# EAGLE design sim900 (EAGLE 6.4)
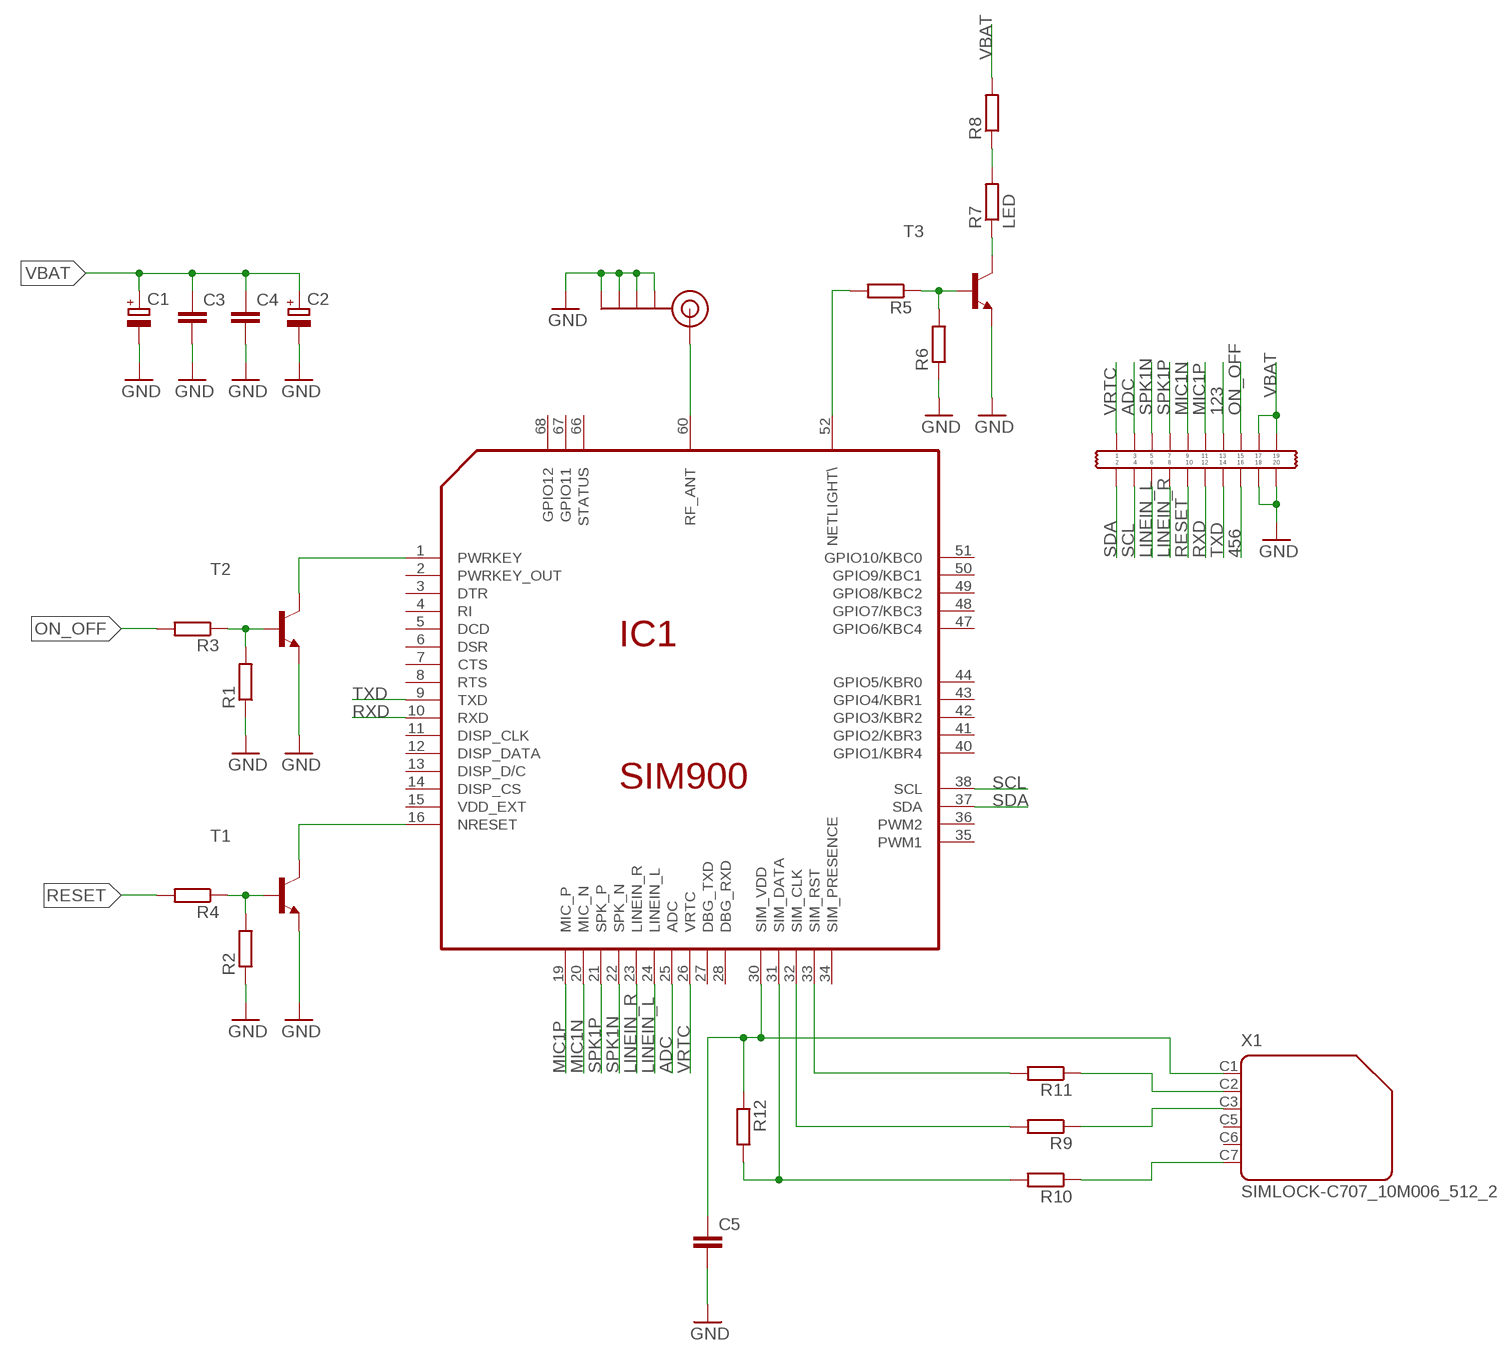
[diagram p0: schematic, sheet 1]

## Parts
C1  CPOL-EUSMCD  [SMC_D]
C2  CPOL-EUSMCD  [SMC_D]
C3  C-EUC0805K  [C0805K]
C4  C-EUC0805K  [C0805K]
C5  C-EUC1206K  [C1206K]
IC1  SIM900  [SIM900]
J$1  SMA_EDGE  [SMA-EDGE]
R1  R-EU_R0805  [R0805]
R2  R-EU_R0805  [R0805]
R3  R-EU_R0805  [R0805]
R4  R-EU_R0805  [R0805]
R5  R-EU_R0805  [R0805]
R6  R-EU_R0805  [R0805]
R7  LED  R-EU_R0805  [R0805]
R8  R-EU_R0805  [R0805]
R9  R-EU_R0805  [R0805]
R10  R-EU_R0805  [R0805]
R11  R-EU_R0805  [R0805]
R12  R-EU_R0805  [R0805]
T1  -NPN-SOT23-EBC  [SOT23-EBC]
T2  -NPN-SOT23-EBC  [SOT23-EBC]
T3  -NPN-SOT23-EBC  [SOT23-EBC]
U$1  2X10  [2X10]
X1  SIMLOCK-C707_10M006_512_2  [C707_10M006_512_2]

## Nets
123: U$1.T13(C13)
456: U$1.B16(C16)
ADC: IC1.25(ADC) U$1.T3(C3)
GND: C1.- C2.- C3.2 C4.2 C5.2 J$1.GND@0(GND) J$1.GND@1(GND) J$1.GND@2(GND) J$1.GND@3(GND) R1.1 R2.1 R6.1 T1.E T2.E T3.E U$1.B18(C18) U$1.B20(C20)
LINEIN_L: IC1.24(LINEIN_L) U$1.B6(C6)
LINEIN_R: IC1.23(LINEIN_R) U$1.B8(C8)
MIC1N: IC1.20(MIC_N) U$1.T9(C9)
MIC1P: IC1.19(MIC_P) U$1.T11(C11)
N$1: IC1.60(RF_ANT) J$1.SIG(SIGNAL)
N$2: IC1.1(PWRKEY) T2.C
N$3: IC1.16(NRESET) T1.C
N$4: R2.2 R4.1 T1.B
N$5: R1.2 R3.1 T2.B
N$6: C5.1 IC1.30(SIM_VDD) R12.1 X1.C1
N$7: R7.2 R8.1
N$8: R5.1 R6.2 T3.B
N$9: IC1.52(NETLIGHT\) R5.2
N$10: R7.1 T3.C
N$11: R11.1 X1.C2
N$12: IC1.33(SIM_RST) R11.2
N$13: R9.1 X1.C3
N$14: R10.1 X1.C7
N$15: IC1.32(SIM_CLK) R9.2
N$16: IC1.31(SIM_DATA) R10.2 R12.2
ON_OFF: R3.2 U$1.T15(C15)
RESET: R4.2 U$1.B10(C10)
RXD: IC1.10(RXD) U$1.B12(C12)
SCL: IC1.38(SCL) U$1.B4(C4)
SDA: IC1.37(SDA) U$1.B2(C2)
SPK1N: IC1.22(SPK_N) U$1.T5(C5)
SPK1P: IC1.21(SPK_P) U$1.T7(C7)
TXD: IC1.9(TXD) U$1.B14(C14)
VBAT: C1.+ C2.+ C3.1 C4.1 R8.2 U$1.T17(C17) U$1.T19(C19)
VRTC: IC1.26(VRTC) U$1.T1(C1)
Unconnected: IC1.2(PWRKEY_OUT) IC1.3(DTR) IC1.4(RI) IC1.5(DCD) IC1.6(DSR) IC1.7(CTS) IC1.8(RTS) IC1.11(DISP_CLK) IC1.12(DISP_DATA) IC1.13(DISP_D/C) IC1.14(DISP_CS) IC1.15(VDD_EXT) IC1.27(DBG_TXD) IC1.28(DBG_RXD) IC1.34(SIM_PRESENCE) IC1.35(PWM1) IC1.36(PWM2) IC1.40(GPIO1/KBR4) IC1.41(GPIO2/KBR3) IC1.42(GPIO3/KBR2) IC1.43(GPIO4/KBR1) IC1.44(GPIO5/KBR0) IC1.47(GPIO6/KBC4) IC1.48(GPIO7/KBC3) IC1.49(GPIO8/KBC2) IC1.50(GPIO9/KBC1) IC1.51(GPIO10/KBC0) IC1.66(STATUS) IC1.67(GPIO11) IC1.68(GPIO12) X1.C5 X1.C6

## Power pins joined to a net without a drawn wire
GND: IC1.17(GND) IC1.18(GND) IC1.29(GND) IC1.39(GND) IC1.45(GND) IC1.46(GND) IC1.53(GND) IC1.54(GND) IC1.58(GND) IC1.59(GND) IC1.61(GND) IC1.62(GND) IC1.63(GND) IC1.64(GND) IC1.65(GND)
VBAT: IC1.55(VBAT) IC1.56(VBAT) IC1.57(VBAT)

## Library data of the parts
C1 C2 = rcl:CPOL-EU: POLARIZED CAPACITOR, European symbol
C3-C5 = rcl:C-EU: CAPACITOR, European symbol
IC1 = sim900:SIM900
J$1 = SparkFun-Connectors:SMA_EDGE: SMA Antenna Connector End launch SMA connector. The paste layer has been removed so that the connector can be hand soldered onto the board after reflow.
R1-R12 = rcl:R-EU_: RESISTOR, European symbol
T1-T3 = transistor:*-NPN-: NPN Transistror BF959 corrected 2008.03.06
U$1 = pinhead_edge:2X10
X1 = con-amphenol:SIMLOCK-C707_10M006_512_2: C707A SIMLOCK® 2.5 mm with wide solder tails Source: Data sheet <http://www.amphenol.info/downloads/C707_10M006_512_2.pdf>; OC_FARNELL: unknown; OC_NEWARK: unknown

## Board
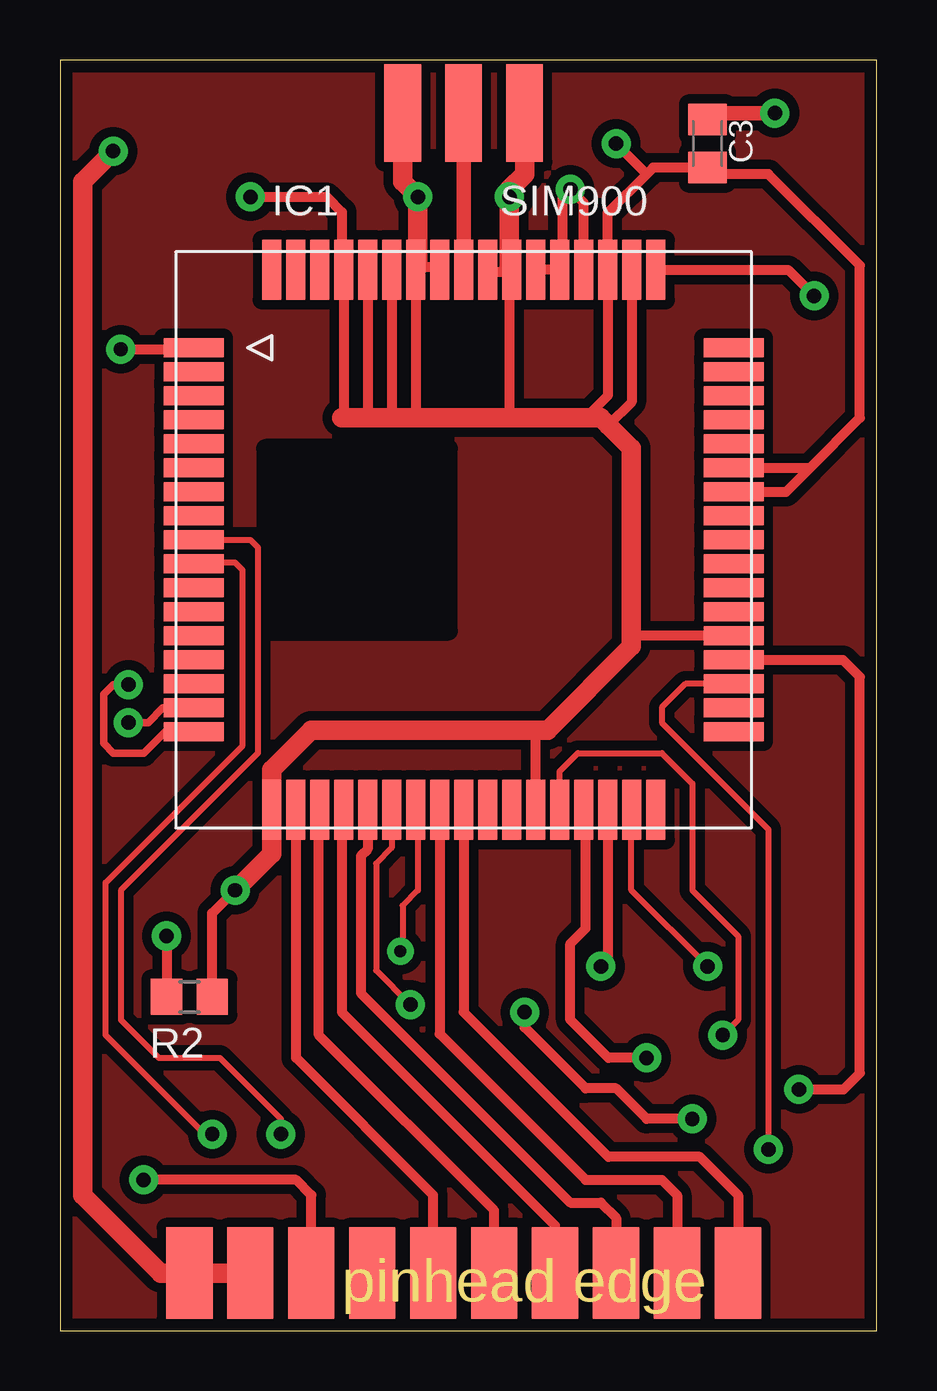
[diagram p1: board, top side]
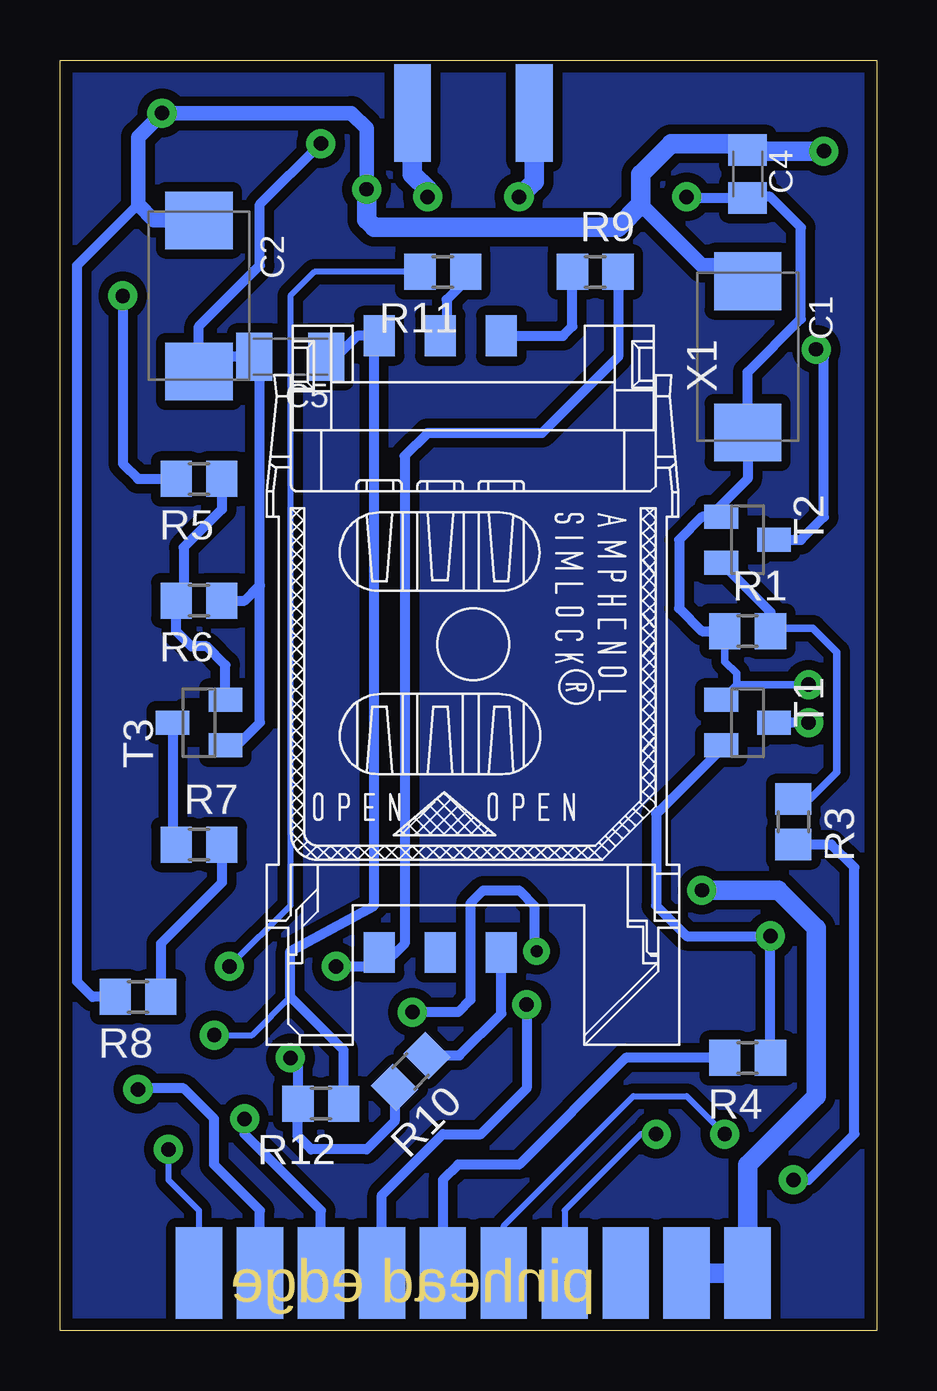
[diagram p2: board, bottom side, seen from below]

Size 34.04 x 52.95 mm. Coordinates in mm from the lower left corner, seen from the top.
Outline: 0,0 34.04,0 34.04,52.95 0,52.95 0,0
Copper layers (1*16): Top 0.035mm / dielectric 1.5mm / Bottom 0.035mm
Design rules "default": minimum track width 12mil, minimum drill 32mil, track to track 12mil, track to pad 12mil, pad to pad 12mil, via to via 12mil, smd to smd 8mil, copper to edge 20mil, drill to drill 20mil, minimum pad ring 25mil, minimum via ring 12mil, stop-mask expansion 4mil, vias tented up to drill 0mil, thermal gap 10mil
tRestrict: area 8.6,29.2 to 16.2,36.8; area 14.3,39 to 18.1,42.8; area 14.9,45.7 to 18.7,48.8
bRestrict: area 4.8,32.3 to 6.7,33.6; area 4.8,24.7 to 6,26.6; area 27.6,24.7 to 28.9,26

### Footprints (pad centres in the part's own frame; a part is rotated, then mirrored left to right if it is on the bottom)
SMC_D = smd 2.4 x 2.8: + -3.15,0; - 3.15,0
C0805K = smd 1.3 x 1.6: 1 -1,0; 2 1,0
C1206K = smd 1.5 x 2: 1 -1.5,0; 2 1.5,0
SIM900 = smd 2.5 x 0.8: 1 -11.25,8; 2 -11.25,7; 3 -11.25,6; 4 -11.25,5; 5 -11.25,4; 6 -11.25,3; 7 -11.25,2; 8 -11.25,1; 9 -11.25,0; 10 -11.25,-1; 11 -11.25,-2; 12 -11.25,-3; 13 -11.25,-4; 14 -11.25,-5; 15 -11.25,-6; 16 -11.25,-7; 17 -11.25,-8; 35 11.25,-8; 36 11.25,-7; 37 11.25,-6; 38 11.25,-5; 39 11.25,-4; 40 11.25,-3; 41 11.25,-2; 42 11.25,-1; 43 11.25,0; 44 11.25,1; 45 11.25,2; 46 11.25,3; 47 11.25,4; 48 11.25,5; 49 11.25,6; 50 11.25,7; 51 11.25,8 | smd 0.8 x 2.5: 18 -8,-11.25; 19 -7,-11.25; 20 -6,-11.25; 21 -5,-11.25; 22 -4,-11.25; 23 -3,-11.25; 24 -2,-11.25; 25 -1,-11.25; 26 0,-11.25; 27 1,-11.25; 28 2,-11.25; 29 3,-11.25; 30 4,-11.25; 31 5,-11.25; 32 6,-11.25; 33 7,-11.25; 34 8,-11.25; 52 8,11.25; 53 7,11.25; 54 6,11.25; 55 5,11.25; 56 4,11.25; 57 3,11.25; 58 2,11.25; 59 1,11.25; 60 0,11.25; 61 -1,11.25; 62 -2,11.25; 63 -3,11.25; 64 -4,11.25; 65 -5,11.25; 66 -6,11.25; 67 -7,11.25; 68 -8,11.25
SMA-EDGE = smd 1.524 x 4.064: GND@0 0,0; GND@1 5.08,0; SIG 2.54,0 | smd 1.524 x 4.064 bottom: GND@2 0,0; GND@3 5.08,0
R0805 = smd 1.3 x 1.5: 1 -0.95,0; 2 0.95,0
SOT23-EBC = smd 1 x 1.4: B 0.95,-1.1; C 0,1.1; E -0.95,-1.1
2X10 = smd 1.93 x 3.81 bottom: B2 -12.7,0; B4 -10.16,0; B6 -7.62,0; B8 -5.08,0; B10 -2.54,0; B12 0,0; B14 2.54,0; B16 5.08,0; B18 7.62,0; B20 10.16,0 | smd 1.93 x 3.81: T1 -12.7,0; T3 -10.16,0; T5 -7.62,0; T7 -5.08,0; T9 -2.54,0; T11 0,0; T13 2.54,0; T15 5.08,0; T17 7.62,0; T19 10.16,0
C707_10M006_512_2 = smd 1.7 x 1.3: C1 -12.85,-3.915; C2 -12.85,-1.375; C3 -12.85,1.165; C5 12.85,-3.915; C6 12.85,-1.375; C7 12.85,1.165

### Placement (x,y rotation side)
C1  5.39,40.58 270 bottom
C2  28.25,43.12 270 bottom
C3  26.98,49.47 270 top
C4  5.39,48.2 270 bottom
C5  24.44,40.58 180 bottom
IC1  16.82,32.97 0 top
J$1  14.28,50.75 0 top
R1  5.39,29.15 0 bottom
R2  5.39,13.91 180 top
R3  3.48,21.22 270 bottom
R4  5.39,11.38 180 bottom
R5  28.25,35.5 180 bottom
R6  28.25,30.43 180 bottom
R7  28.25,20.27 0 bottom
R8  30.79,13.91 180 bottom
R9  11.74,44.12 0 bottom
R10  19.43,10.81 225 bottom
R11  18.09,44.12 180 bottom
R12  23.17,9.47 180 bottom
T1  5.39,25.35 270 bottom
T2  5.39,32.97 270 bottom
T3  28.25,25.35 90 bottom
U$1  15.55,2.4 180 top
X1  16.82,28.61 270 bottom

### Tracks (layer width: path | path; a pad name or v marks a point on that pad's centre or on a via)
ADC
  Top 0.406: IC1.25 15.82,12.38 21.9,6.3 25.08,6.3 25.71,5.66 U$1.T3
GND  (via drill 0.6)
  Top 0.305: IC1.17 4.38,24.96 3.48,24.07 2.22,24.07 1.82,24.48 1.82,26.53 2.22,26.93 v2.85,26.93
  Top 0.406: v7.93,47.25 11.11,47.25 11.74,46.62 11.74,44.39 | 11.74,44.39 11.74,44.3 IC1.65 | 24.44,48.2 24.71,48.47 C3.2 27.25,48.2 29.52,48.2 33.33,44.39 33.33,38.05 31.25,35.97 | 24.44,48.2 22.82,46.58 IC1.54 22.82,38.97 21.9,38.05 | 8.88,21.78 IC1.18 | 11.92,44.22 11.74,44.39 | 11.74,44.14 IC1.65 | IC1.61 15.73,44.31 14.91,44.31 | IC1.46 31.25,35.97 | 18.73,44.12 IC1.58 18.73,44.31 18.73,44.12 | R2.1 6.34,17.41 v7.3,18.36 | IC1.29 19.82,24.85 20,25.03 | IC1.39 24,28.96 23.81,29.15 | IC1.65 11.82,38.12 11.74,38.05 | IC1.64 12.82,38.23 13.01,38.05 | IC1.63 13.82,38.22 13.65,38.05 | IC1.62 14.82,38.14 14.91,38.05 | 18.73,44.12 18.73,38.05 | 18.73,44.12 17.91,44.12 IC1.59 | 19.36,49.47 19.36,50.11 J$1.GND@3 | v23.17,49.47 24.44,48.2 | IC1.53 23.82,38.69 22.85,37.73 | IC1.45 30.25,34.97 31.25,35.97
  Top 0.813: v7.3,18.36 8.82,19.89 IC1.18 8.82,23.38 10.47,25.03 20,25.03 20.31,25.03 23.81,28.52 23.81,29.15 23.81,36.78 22.85,37.73 22.54,38.05 21.9,38.05 18.73,38.05 14.91,38.05 13.65,38.05 13.01,38.05 11.74,38.05 | 18.73,44.31 v18.73,47.25 18.73,47.57 19.36,48.2 19.36,50.11 | J$1.GND@2 14.28,47.89 v14.91,47.25 14.91,44.31 IC1.62
  Bottom 0.305: v2.85,26.93 5.85,26.93 | 5.85,26.93 T1.E | 5.85,26.93 5.85,27.39 6.34,27.89 R1.1
  Bottom 0.406: R1.1 7.3,29.15 8.25,30.11 8.25,32.97 7.3,33.92 T2.E 6.66,34.08 6.66,34.23 5.39,35.5 C1.- 5.39,39.95 3.17,42.17 3.17,45.98 4.44,47.25 5.34,47.25 C4.2 7.88,47.2 v7.93,47.25 | v23.17,49.47 25.71,46.94 25.71,44.39 28.25,41.86 C2.- 27.64,40.58 C5.2 25.71,40.31 25.71,31.06 | R6.1 26.34,30.43 25.71,31.06 | T3.E 26.66,24.39 25.71,25.35 25.71,31.06
  Bottom 0.813: v7.3,18.36 4.12,18.36 2.53,16.77 2.53,9.79 5.39,6.93 U$1.B20 U$1.B18 | J$1.GND@3 19.36,48.2 18.73,47.57 v18.73,47.25 | v14.91,47.25 14.28,47.89 J$1.GND@2
LINEIN_L  (via drill 0.5 pad 0.61, 0.6)
  Top 0.254: 14.91,21.62 14.91,18.36 14.28,17.73 14.28,15.92 v14.18,15.82
  Top 0.406: v26.34,8.84 24.44,8.84 23.17,10.11 21.9,10.11 19.36,12.64 v19.36,13.28 | 14.91,21.62 IC1.24
  Bottom 0.406: U$1.B6 23.17,5.03 26.34,8.2 v26.34,8.84 | v19.36,13.28 17.45,13.28 16.94,13.8 16.94,17.82 16.4,18.36 14.91,18.36 14.28,17.73 14.28,15.92 v14.18,15.82
LINEIN_R  (via drill 0.6)
  Top 0.254: IC1.23 13.82,20.12 13.17,19.47 13.17,15.03 v14.6,13.6
  Bottom 0.406: U$1.B8 20.63,5.66 18.09,8.2 16.5,8.2 14.6,10.11 v14.6,13.6
MIC1N
  Top 0.406: U$1.T9 18.09,5.03 10.79,12.33 10.79,21.68 IC1.20
MIC1P
  Top 0.406: U$1.T11 15.55,5.66 9.84,11.38 9.84,21.7 IC1.19
N$1
  Top 0.61: IC1.60 J$1.SIG
N$2  (via drill 0.6)
  Top 0.406: v2.53,40.9 5.51,40.9 IC1.1
  Bottom 0.406: T2.C 3.17,32.97 2.22,33.92 2.22,40.58 v2.53,40.9
N$3  (via drill 0.6)
  Top 0.305: IC1.16 4.29,25.96 3.67,25.35 v2.85,25.35
  Top 0.406: 5.55,25.98 IC1.16
  Bottom 0.406: v2.85,25.35 T1.C
N$4  (via drill 0.6)
  Top 0.406: v4.44,16.46 R2.2
  Bottom 0.406: T1.B 6.49,24.25 9.2,21.54 9.2,17.73 7.93,16.46 v4.44,16.46 v4.44,16.45 R4.1
N$5
  Bottom 0.305: R3.1 2.79,22.17 1.67,23.29 1.67,28.29 2.67,29.29 4.31,29.29 R1.2
  Bottom 0.406: R1.2 4.44,29.96 T2.B
N$6  (via drill 0.6)
  Top 0.254: IC1.30 20.82,23.31 21.58,24.07 25.08,24.07 26.34,22.81 26.34,18.36 28.25,16.46 28.25,12.96 v27.61,12.33
  Bottom 0.254: v27.61,12.33 26.03,12.33 24.44,13.91
  Bottom 0.406: R12.1 22.22,11.7 24.44,13.91 24.44,15.82 20.95,17.73 20.95,41.25 X1.C1 21.66,41.47 22.54,40.58 C5.1
N$7
  Bottom 0.406: R7.2 27.3,18.68 29.84,16.14 R8.1
N$8
  Bottom 0.406: R5.1 27.3,34.23 28.89,32.65 28.89,30.74 R6.2 29.2,29.15 28.57,28.52 27.93,28.52 27.15,27.74 T3.B
N$9  (via drill 0.6)
  Top 0.406: IC1.52 30.34,44.22 v31.42,43.12
  Bottom 0.406: v31.42,43.12 31.42,36.14 30.79,35.5 R5.2
N$10
  Bottom 0.406: T3.C 29.35,20.41 R7.1
N$11
  Bottom 0.406: R11.1 17.14,43.76 17.93,42.97 17.93,41.73 X1.C2
N$12  (via drill 0.6)
  Top 0.254: IC1.33 23.81,21.7 23.81,18.36 v26.98,15.18
  Bottom 0.254: R11.2 23.44,44.12 24.44,43.12 24.44,17.73 v26.98,15.18
N$13
  Bottom 0.406: X1.C3 13.08,41.47 12.69,41.86 R9.1
N$14
  Bottom 0.406: R10.1 17.4,11.48 15.65,13.23 X1.C7
N$15  (via drill 0.6)
  Top 0.406: IC1.32 22.82,15.47 v22.54,15.18
  Bottom 0.406: R9.2 10.79,40.58 13.96,37.41 18.73,37.41 19.68,36.46 19.68,16.14 20.63,15.18 v22.54,15.18
N$16  (via drill 0.6)
  Top 0.406: v24.44,11.38 22.85,11.38 21.27,12.96 21.27,16.14 21.9,16.77 21.9,21.64 IC1.31
  Bottom 0.406: v24.44,11.38 24.12,11.05 R12.2 24.14,9.45 24.14,8.12 23.58,7.57 21.27,7.57 20.1,8.73 R10.2
N$17
  pour Top (isolate 0.4, rank 6): -0.01,52.97 33.97,52.97 33.97,-0.05 -0.01,-0.05
N$18
  pour Bottom (isolate 0.4): -0.01,52.97 33.97,52.97 33.97,-0.05 -0.01,-0.05
ON_OFF  (via drill 0.6)
  Top 0.406: U$1.T15 10.47,5.66 9.84,6.3 v3.48,6.3
  Bottom 0.406: v3.48,6.3 2.85,6.3 0.95,8.2 0.95,19.31 1.9,20.27 R3.2
RESET
  Bottom 0.406: R4.2 10.47,11.38 14.91,6.93 17.45,6.93 18.09,6.3 U$1.B10
RXD  (via drill 0.6)
  Top 0.254: v6.34,8.2 6.02,8.2 1.9,12.33 1.9,18.68 7.61,24.39 7.61,31.69 7.3,32.01 5.62,32.01 IC1.10
  Bottom 0.254: U$1.B12 15.55,4.39 10.15,9.79 7.93,9.79 v6.34,8.2
SCL  (via drill 0.6)
  Top 0.406: v30.79,10.07 32.66,10.07 33.33,10.74 33.33,27.25 32.61,27.96 IC1.38
  Bottom 0.406: U$1.B4 25.71,5.03 27.61,6.93 27.61,8.84 28.89,10.11 30.75,10.11 v30.79,10.07
SDA  (via drill 0.6)
  Top 0.254: IC1.37 26.06,26.96 25.08,25.98 25.08,25.35 29.52,20.9 v29.52,7.57
  Bottom 0.254: v29.52,7.57 29.52,6.3 28.25,5.03 U$1.B2
SPK1N
  Top 0.406: U$1.T5 23.17,4.71 22.54,5.34 21.27,5.34 12.53,14.07 12.53,19.79 12.82,20.07 IC1.22
SPK1P
  Top 0.406: U$1.T7 20.63,4.39 11.74,13.28 11.74,19 11.74,21.64 IC1.21
TXD  (via drill 0.6)
  Top 0.254: IC1.9 7.93,32.97 8.25,32.65 8.25,24.07 2.53,18.36 2.53,12.96 4.12,11.38 6.66,11.38 9.2,8.84 v9.2,8.2
  Bottom 0.254: v9.2,8.2 9.84,8.2 13.01,5.03 U$1.B14
VBAT  (via drill 0.6)
  Top 0.305: IC1.56 20.95,44.08
  Top 0.406: IC1.56 IC1.57 | 27.25,50.75 C3.1 | U$1.T17 U$1.T19 | IC1.55 21.82,47.02 v21.27,47.57 20.95,47.25 20.95,44.08
  Top 0.61: 27.25,50.75 v29.79,50.75
  Top 0.813: U$1.T17 4.2,2.4 0.95,5.66 0.95,47.89 v2.22,49.16
  Bottom 0.406: 5.66,49.47 C4.1 | 4.73,44.39 C1.+ | R8.2 32.7,13.91 33.33,14.55 33.33,44.39 30.79,46.94
  Bottom 0.61: 4.73,44.39 7.3,44.39 9.84,46.94 | C2.+ 30.13,46.28 30.79,46.94 30.79,49.75 v29.79,50.75 21.9,50.75 21.27,50.11 v21.27,47.57
  Bottom 0.813: v2.22,49.16 5.34,49.16 C4.1 | 5.66,49.47 8.57,49.47 9.84,48.2 9.84,46.94 10.79,45.98 20.95,45.98 21.27,46.3 v21.27,47.57
VRTC
  Top 0.406: IC1.26 16.82,13.28 22.85,7.25 26.66,7.25 28.25,5.66 U$1.T1

### Text on the board
Dimension: pinhead edge